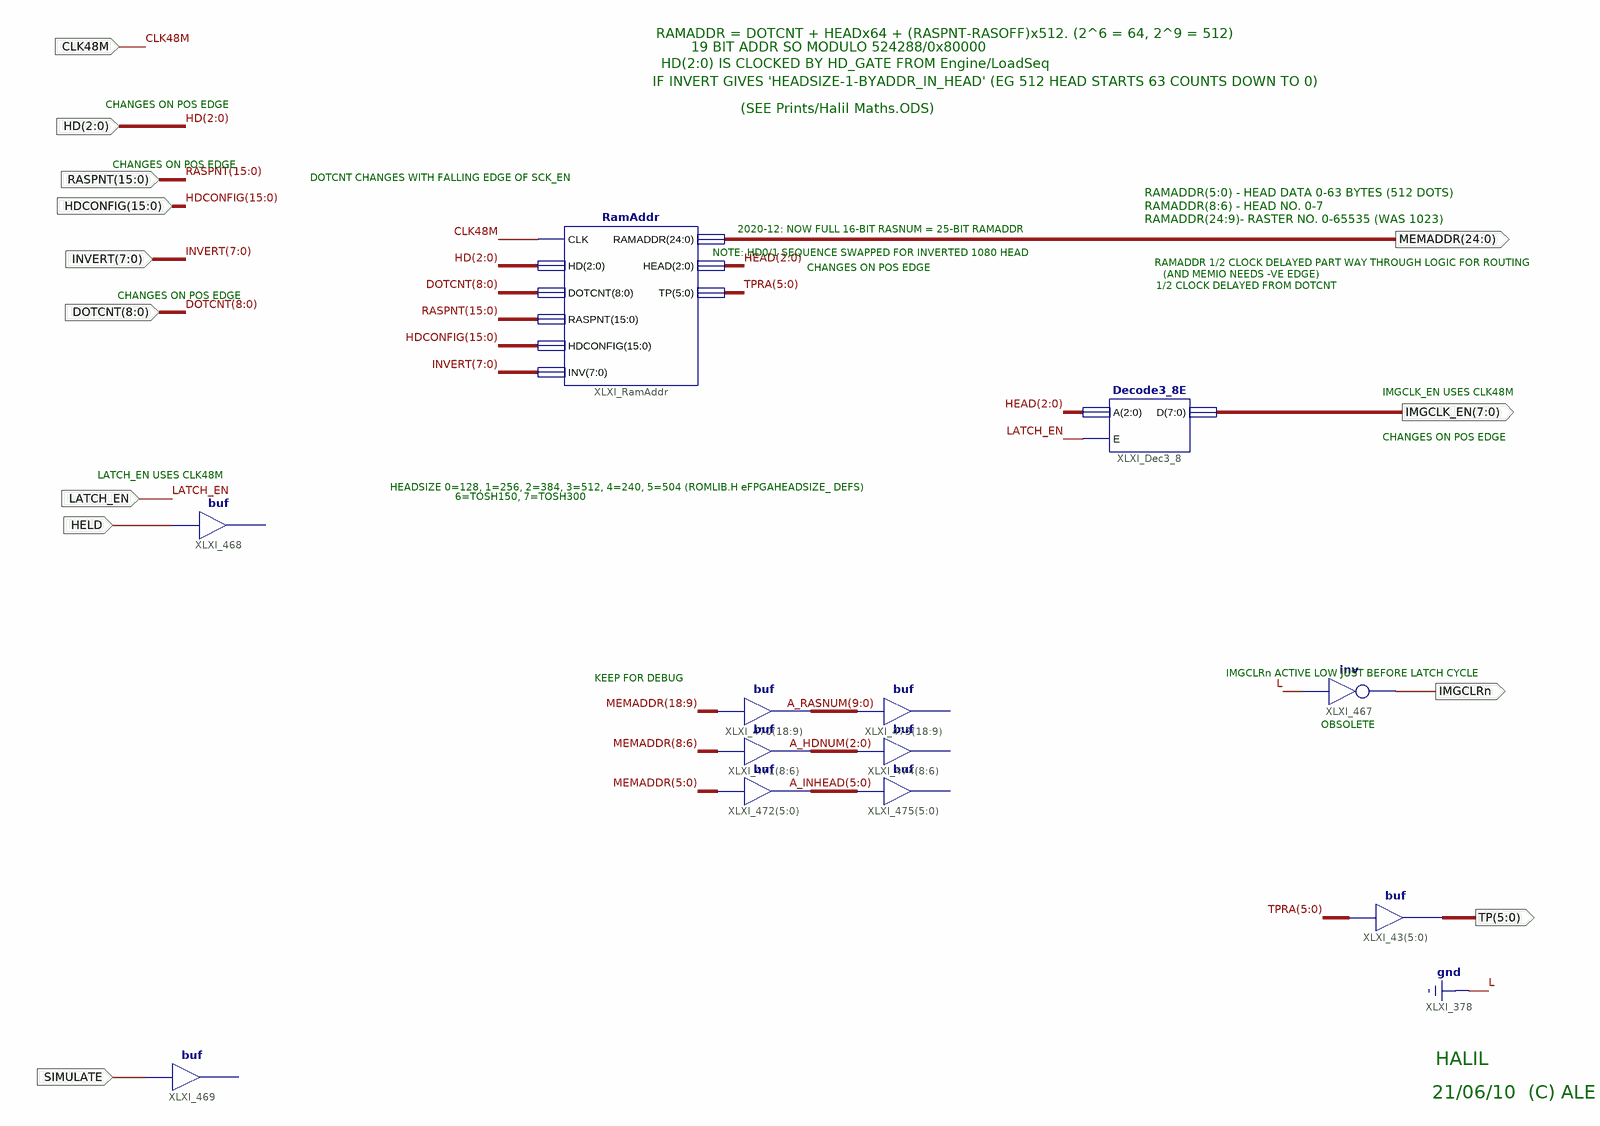
[diagram p0: schematic sheet 1]
// Xilinx ISE schematic Halil.sch (spartan3e) as structural Verilog: 12 symbols, 13 ports
module Halil (
  input  CLK48M,
  input  LATCH_EN,
  input  [2:0] HD,
  input  [15:0] RASPNT,
  input  [7:0] INVERT,
  input  [8:0] DOTCNT,
  input  HELD,
  input  SIMULATE,
  input  [15:0] HDCONFIG,
  output [5:0] TP,
  output [24:0] MEMADDR,
  output IMGCLRn,
  output [7:0] IMGCLK_EN
);

  wire [2:0] A_HDNUM, HEAD;
  wire [5:0] A_INHEAD, TPRA;
  wire [9:0] A_RASNUM;

  assign TP = TPRA;  // buf XLXI_43[5..0], 6 bits wide
  // buf XLXI_468 has open pins: I=HELD, O=open
  // buf XLXI_469 has open pins: I=SIMULATE, O=open
  not XLXI_467 (IMGCLRn, 1'b0);
  assign A_RASNUM = MEMADDR[18:9];  // buf XLXI_470[18..9], 10 bits wide
  assign A_HDNUM = MEMADDR[8:6];  // buf XLXI_471[8..6], 3 bits wide
  assign A_INHEAD = MEMADDR[5:0];  // buf XLXI_472[5..0], 6 bits wide
  // buf XLXI_473[18..9] has open pins: I=A_RASNUM, O=open
  // buf XLXI_474[8..6] has open pins: I=A_HDNUM, O=open
  // buf XLXI_475[5..0] has open pins: I=A_INHEAD, O=open
  Decode3_8E XLXI_Dec3_8 (.A(HEAD), .D(IMGCLK_EN), .E(LATCH_EN));
  RamAddr XLXI_RamAddr (
    .CLK(CLK48M), .DOTCNT(DOTCNT), .HD(HD), .HDCONFIG(HDCONFIG), .HEAD(HEAD), .INV(INVERT),
    .RAMADDR(MEMADDR), .RASPNT(RASPNT), .TP(TPRA));

  // Notes on the sheet:
  //   RAMADDR = DOTCNT + HEADx64 + (RASPNT-RASOFF)x512. (2^6 = 64, 2^9 = 512)
  //   19 BIT ADDR SO MODULO 524288/0x80000
  //   HD(2:0) IS CLOCKED BY HD_GATE FROM Engine/LoadSeq
  //   IF INVERT GIVES 'HEADSIZE-1-BYADDR_IN_HEAD' (EG 512 HEAD STARTS 63 COUNTS DOWN TO 0)
  //   CHANGES ON POS EDGE
  //   (SEE Prints/Halil Maths.ODS)
  //   CHANGES ON POS EDGE
  //   DOTCNT CHANGES WITH FALLING EDGE OF SCK_EN
  //   RAMADDR(5:0) - HEAD DATA 0-63 BYTES (512 DOTS)
  //   RAMADDR(8:6) - HEAD NO. 0-7
  //   RAMADDR(24:9)- RASTER NO. 0-65535 (WAS 1023)
  //   2020-12: NOW FULL 16-BIT RASNUM = 25-BIT RAMADDR
  //   NOTE: HD0/1 SEQUENCE SWAPPED FOR INVERTED 1080 HEAD
  //   RAMADDR 1/2 CLOCK DELAYED PART WAY THROUGH LOGIC FOR ROUTING
  //   CHANGES ON POS EDGE
  //   (AND MEMIO NEEDS -VE EDGE)
  //   1/2 CLOCK DELAYED FROM DOTCNT
  //   CHANGES ON POS EDGE
  //   IMGCLK_EN USES CLK48M
  //   CHANGES ON POS EDGE
  //   LATCH_EN USES CLK48M
  //   HEADSIZE 0=128, 1=256, 2=384, 3=512, 4=240, 5=504 (ROMLIB.H eFPGAHEADSIZE_ DEFS)
  //   6=TOSH150, 7=TOSH300
  //   IMGCLRn ACTIVE LOW JUST BEFORE LATCH CYCLE
  //   KEEP FOR DEBUG
  //   OBSOLETE
  //   HALIL
  //   21/06/10  (C) ALE
endmodule
